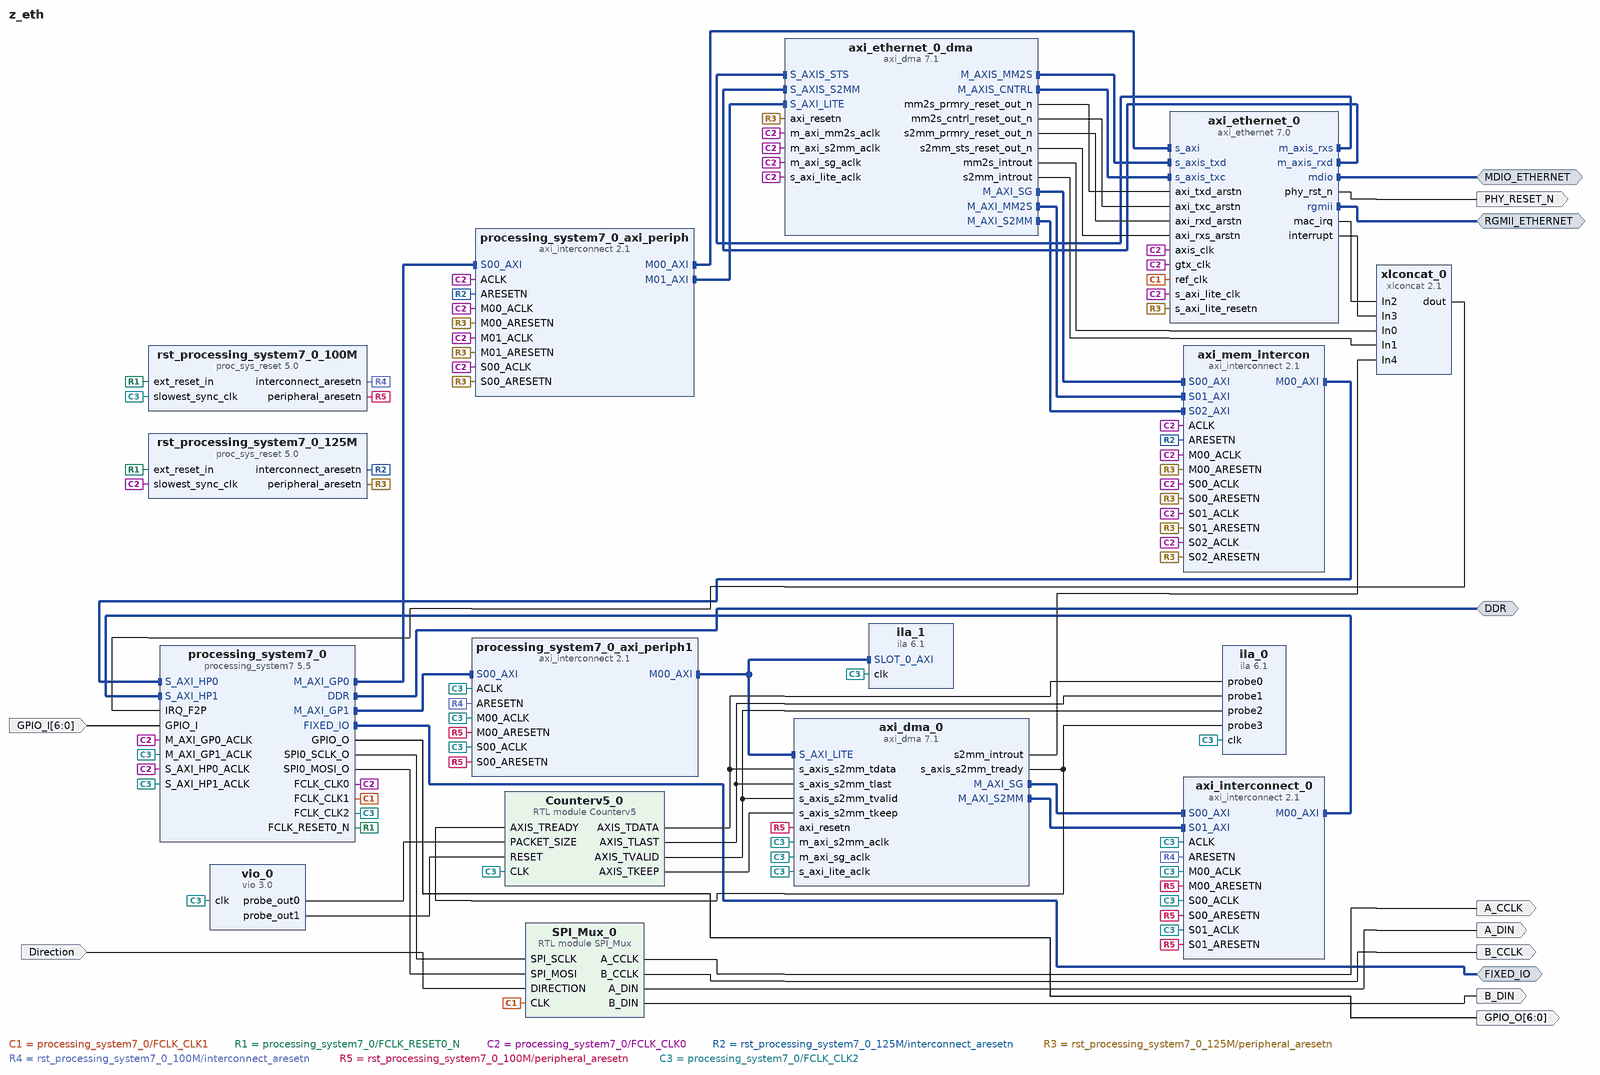
[diagram p0: block diagram of the top level]
# Vivado block design z_eth, Vivado 2016.1
create_bd_design z_eth

create_bd_intf_port -mode Master -vlnv xilinx.com:interface:ddrx_rtl:1.0 DDR
create_bd_intf_port -mode Master -vlnv xilinx.com:display_processing_system7:fixedio_rtl:1.0 FIXED_IO
create_bd_intf_port -mode Master -vlnv xilinx.com:interface:mdio_rtl:1.0 MDIO_ETHERNET
create_bd_intf_port -mode Master -vlnv xilinx.com:interface:rgmii_rtl:1.0 RGMII_ETHERNET
create_bd_port -dir O A_CCLK
create_bd_port -dir O B_CCLK
create_bd_port -dir O A_DIN
create_bd_port -dir O B_DIN
create_bd_port -dir I Direction
create_bd_port -dir O -from 6 -to 0 GPIO_O
create_bd_port -dir I -from 6 -to 0 GPIO_I
create_bd_port -dir O -type rst PHY_RESET_N
set_property -dict {CONFIG.POLARITY ACTIVE_LOW} [get_bd_ports PHY_RESET_N]

create_bd_cell -type ip -vlnv xilinx.com:ip:processing_system7:5.5 processing_system7_0
set_property -dict [list \
  CONFIG.PCW_SPI_PERIPHERAL_FREQMHZ 200 \
  CONFIG.PCW_FPGA0_PERIPHERAL_FREQMHZ 125 \
  CONFIG.PCW_FPGA1_PERIPHERAL_FREQMHZ 200 \
  CONFIG.PCW_FPGA2_PERIPHERAL_FREQMHZ 100 \
  CONFIG.PCW_USE_M_AXI_GP1 1 \
  CONFIG.PCW_USE_S_AXI_HP0 1 \
  CONFIG.PCW_USE_S_AXI_HP1 1 \
  CONFIG.PCW_USE_FABRIC_INTERRUPT 1 \
  CONFIG.PCW_EN_CLK1_PORT 1 \
  CONFIG.PCW_EN_CLK2_PORT 1 \
  CONFIG.PCW_IRQ_F2P_INTR 1 \
  CONFIG.PCW_UIPARAM_DDR_PARTNO {MT41J128M16 HA-125} \
  CONFIG.PCW_QSPI_PERIPHERAL_ENABLE 1 \
  CONFIG.PCW_QSPI_QSPI_IO {MIO 1 .. 6} \
  CONFIG.PCW_QSPI_GRP_SINGLE_SS_ENABLE 1 \
  CONFIG.PCW_ENET0_PERIPHERAL_ENABLE 0 \
  CONFIG.PCW_SD0_PERIPHERAL_ENABLE 1 \
  CONFIG.PCW_SD0_SD0_IO {MIO 16 .. 21} \
  CONFIG.PCW_SD0_GRP_CD_ENABLE 0 \
  CONFIG.PCW_UART0_PERIPHERAL_ENABLE 1 \
  CONFIG.PCW_UART0_UART0_IO {MIO 26 .. 27} \
  CONFIG.PCW_SPI0_PERIPHERAL_ENABLE 1 \
  CONFIG.PCW_SPI0_SPI0_IO EMIO \
  CONFIG.PCW_I2C0_PERIPHERAL_ENABLE 1 \
  CONFIG.PCW_I2C0_I2C0_IO {MIO 30 .. 31} \
  CONFIG.PCW_GPIO_MIO_GPIO_ENABLE 0 \
  CONFIG.PCW_GPIO_EMIO_GPIO_ENABLE 1 \
  CONFIG.PCW_GPIO_EMIO_GPIO_IO 7 \
] [get_bd_cells processing_system7_0]
# 3 more settings of processing_system7_0 are not shown: defaults, MIO pin electricals, DDR timing, and values the tool derives
create_bd_cell -type module -reference SPI_Mux SPI_Mux_0
create_bd_cell -type ip -vlnv xilinx.com:ip:axi_ethernet:7.0 axi_ethernet_0
set_property -dict [list \
  CONFIG.PHY_TYPE RGMII \
  CONFIG.RXMEM 16k \
  CONFIG.TXMEM 16k \
  CONFIG.TXCSUM Full \
  CONFIG.RXCSUM Full \
  CONFIG.Statistics_Counters false \
  CONFIG.axiliteclkrate 125 \
  CONFIG.axisclkrate 125 \
] [get_bd_cells axi_ethernet_0]
create_bd_cell -type ip -vlnv xilinx.com:ip:axi_dma:7.1 axi_ethernet_0_dma
set_property -dict [list \
  CONFIG.c_sg_length_width 16 \
  CONFIG.c_include_mm2s_dre 1 \
  CONFIG.c_mm2s_burst_size 256 \
  CONFIG.c_sg_use_stsapp_length 1 \
  CONFIG.c_include_s2mm_dre 1 \
  CONFIG.c_s2mm_burst_size 256 \
] [get_bd_cells axi_ethernet_0_dma]
create_bd_cell -type ip -vlnv xilinx.com:ip:axi_interconnect:2.1 axi_mem_intercon
set_property -dict {CONFIG.NUM_SI 3 CONFIG.NUM_MI 1} [get_bd_cells axi_mem_intercon]
create_bd_cell -type ip -vlnv xilinx.com:ip:proc_sys_reset:5.0 rst_processing_system7_0_125M
create_bd_cell -type ip -vlnv xilinx.com:ip:axi_interconnect:2.1 processing_system7_0_axi_periph
set_property -dict {CONFIG.NUM_MI 2} [get_bd_cells processing_system7_0_axi_periph]
create_bd_cell -type ip -vlnv xilinx.com:ip:xlconcat:2.1 xlconcat_0
set_property -dict {CONFIG.NUM_PORTS 5} [get_bd_cells xlconcat_0]
create_bd_cell -type ip -vlnv xilinx.com:ip:axi_dma:7.1 axi_dma_0
set_property -dict [list \
  CONFIG.c_sg_length_width 23 \
  CONFIG.c_sg_include_stscntrl_strm 0 \
  CONFIG.c_include_mm2s 0 \
  CONFIG.c_s2mm_burst_size 256 \
] [get_bd_cells axi_dma_0]
create_bd_cell -type ip -vlnv xilinx.com:ip:axi_interconnect:2.1 axi_interconnect_0
set_property -dict {CONFIG.NUM_SI 2 CONFIG.NUM_MI 1} [get_bd_cells axi_interconnect_0]
create_bd_cell -type module -reference Counterv5 Counterv5_0
create_bd_cell -type ip -vlnv xilinx.com:ip:proc_sys_reset:5.0 rst_processing_system7_0_100M
create_bd_cell -type ip -vlnv xilinx.com:ip:axi_interconnect:2.1 processing_system7_0_axi_periph1
set_property -dict {CONFIG.NUM_MI 1} [get_bd_cells processing_system7_0_axi_periph1]
create_bd_cell -type ip -vlnv xilinx.com:ip:vio:3.0 vio_0
set_property -dict [list \
  CONFIG.C_PROBE_OUT1_INIT_VAL 0x1 \
  CONFIG.C_PROBE_OUT0_INIT_VAL 0x00001000 \
  CONFIG.C_PROBE_OUT0_WIDTH 32 \
  CONFIG.C_NUM_PROBE_OUT 2 \
  CONFIG.C_EN_PROBE_IN_ACTIVITY 0 \
  CONFIG.C_NUM_PROBE_IN 0 \
] [get_bd_cells vio_0]
create_bd_cell -type ip -vlnv xilinx.com:ip:ila:6.1 ila_0
set_property -dict [list \
  CONFIG.C_PROBE1_WIDTH 1 \
  CONFIG.C_PROBE0_WIDTH 32 \
  CONFIG.C_DATA_DEPTH 4096 \
  CONFIG.C_NUM_OF_PROBES 4 \
  CONFIG.C_ENABLE_ILA_AXI_MON false \
  CONFIG.C_MONITOR_TYPE Native \
] [get_bd_cells ila_0]
create_bd_cell -type ip -vlnv xilinx.com:ip:ila:6.1 ila_1

# ---- connections ----

connect_bd_intf_net [get_bd_intf_pins axi_ethernet_0_dma/M_AXIS_MM2S] [get_bd_intf_pins axi_ethernet_0/s_axis_txd]
connect_bd_intf_net [get_bd_intf_pins axi_ethernet_0_dma/M_AXIS_CNTRL] [get_bd_intf_pins axi_ethernet_0/s_axis_txc]
connect_bd_intf_net [get_bd_intf_pins axi_ethernet_0_dma/S_AXIS_STS] [get_bd_intf_pins axi_ethernet_0/m_axis_rxs]
connect_bd_intf_net [get_bd_intf_pins axi_ethernet_0_dma/S_AXIS_S2MM] [get_bd_intf_pins axi_ethernet_0/m_axis_rxd]
connect_bd_intf_net [get_bd_intf_pins axi_ethernet_0_dma/M_AXI_SG] [get_bd_intf_pins axi_mem_intercon/S00_AXI]
connect_bd_intf_net [get_bd_intf_pins axi_mem_intercon/M00_AXI] [get_bd_intf_pins processing_system7_0/S_AXI_HP0]
connect_bd_intf_net [get_bd_intf_pins processing_system7_0/M_AXI_GP0] [get_bd_intf_pins processing_system7_0_axi_periph/S00_AXI]
connect_bd_intf_net [get_bd_intf_pins processing_system7_0_axi_periph/M00_AXI] [get_bd_intf_pins axi_ethernet_0/s_axi]
connect_bd_intf_net [get_bd_intf_pins processing_system7_0_axi_periph/M01_AXI] [get_bd_intf_pins axi_ethernet_0_dma/S_AXI_LITE]
connect_bd_intf_net [get_bd_intf_pins axi_ethernet_0_dma/M_AXI_MM2S] [get_bd_intf_pins axi_mem_intercon/S01_AXI]
connect_bd_intf_net [get_bd_intf_pins axi_ethernet_0_dma/M_AXI_S2MM] [get_bd_intf_pins axi_mem_intercon/S02_AXI]
connect_bd_intf_net [get_bd_intf_pins axi_dma_0/M_AXI_SG] [get_bd_intf_pins axi_interconnect_0/S00_AXI]
connect_bd_intf_net [get_bd_intf_pins axi_interconnect_0/S01_AXI] [get_bd_intf_pins axi_dma_0/M_AXI_S2MM]
connect_bd_intf_net [get_bd_intf_pins axi_interconnect_0/M00_AXI] [get_bd_intf_pins processing_system7_0/S_AXI_HP1]
connect_bd_intf_net [get_bd_intf_pins processing_system7_0/M_AXI_GP1] [get_bd_intf_pins processing_system7_0_axi_periph1/S00_AXI]
connect_bd_intf_net [get_bd_intf_pins axi_dma_0/S_AXI_LITE] [get_bd_intf_pins processing_system7_0_axi_periph1/M00_AXI]
connect_bd_intf_net [get_bd_intf_pins axi_dma_0/S_AXI_LITE] [get_bd_intf_pins ila_1/SLOT_0_AXI]
connect_bd_intf_net [get_bd_intf_ports DDR] [get_bd_intf_pins processing_system7_0/DDR]
connect_bd_intf_net [get_bd_intf_ports FIXED_IO] [get_bd_intf_pins processing_system7_0/FIXED_IO]
connect_bd_intf_net [get_bd_intf_ports MDIO_ETHERNET] [get_bd_intf_pins axi_ethernet_0/mdio]
connect_bd_intf_net [get_bd_intf_ports RGMII_ETHERNET] [get_bd_intf_pins axi_ethernet_0/rgmii]
connect_bd_net [get_bd_pins processing_system7_0/SPI0_SCLK_O] [get_bd_pins SPI_Mux_0/SPI_SCLK]
connect_bd_net [get_bd_pins processing_system7_0/SPI0_MOSI_O] [get_bd_pins SPI_Mux_0/SPI_MOSI]
connect_bd_net [get_bd_pins SPI_Mux_0/A_CCLK] [get_bd_ports A_CCLK]
connect_bd_net [get_bd_pins SPI_Mux_0/B_CCLK] [get_bd_ports B_CCLK]
connect_bd_net [get_bd_pins SPI_Mux_0/A_DIN] [get_bd_ports A_DIN]
connect_bd_net [get_bd_pins SPI_Mux_0/B_DIN] [get_bd_ports B_DIN]
connect_bd_net [get_bd_ports Direction] [get_bd_pins SPI_Mux_0/DIRECTION]
connect_bd_net [get_bd_pins processing_system7_0/GPIO_O] [get_bd_ports GPIO_O]
connect_bd_net [get_bd_ports GPIO_I] [get_bd_pins processing_system7_0/GPIO_I]
connect_bd_net [get_bd_pins axi_ethernet_0/phy_rst_n] [get_bd_ports PHY_RESET_N]
connect_bd_net [get_bd_pins processing_system7_0/FCLK_CLK1] [get_bd_pins axi_ethernet_0/ref_clk] [get_bd_pins SPI_Mux_0/CLK]
connect_bd_net [get_bd_pins axi_ethernet_0_dma/mm2s_prmry_reset_out_n] [get_bd_pins axi_ethernet_0/axi_txd_arstn]
connect_bd_net [get_bd_pins axi_ethernet_0_dma/mm2s_cntrl_reset_out_n] [get_bd_pins axi_ethernet_0/axi_txc_arstn]
connect_bd_net [get_bd_pins axi_ethernet_0_dma/s2mm_prmry_reset_out_n] [get_bd_pins axi_ethernet_0/axi_rxd_arstn]
connect_bd_net [get_bd_pins axi_ethernet_0_dma/s2mm_sts_reset_out_n] [get_bd_pins axi_ethernet_0/axi_rxs_arstn]
connect_bd_net [get_bd_pins processing_system7_0/FCLK_RESET0_N] \
  [get_bd_pins rst_processing_system7_0_125M/ext_reset_in] [get_bd_pins rst_processing_system7_0_100M/ext_reset_in]
connect_bd_net [get_bd_pins xlconcat_0/dout] [get_bd_pins processing_system7_0/IRQ_F2P]
connect_bd_net [get_bd_pins axi_ethernet_0_dma/mm2s_introut] [get_bd_pins xlconcat_0/In0]
connect_bd_net [get_bd_pins axi_ethernet_0_dma/s2mm_introut] [get_bd_pins xlconcat_0/In1]
connect_bd_net [get_bd_pins axi_ethernet_0/mac_irq] [get_bd_pins xlconcat_0/In2]
connect_bd_net [get_bd_pins axi_ethernet_0/interrupt] [get_bd_pins xlconcat_0/In3]
connect_bd_net [get_bd_pins processing_system7_0/FCLK_CLK0] \
  [get_bd_pins axi_ethernet_0_dma/s_axi_lite_aclk] [get_bd_pins axi_ethernet_0_dma/m_axi_sg_aclk] \
  [get_bd_pins axi_ethernet_0_dma/m_axi_mm2s_aclk] [get_bd_pins axi_ethernet_0_dma/m_axi_s2mm_aclk] \
  [get_bd_pins processing_system7_0/M_AXI_GP0_ACLK] [get_bd_pins processing_system7_0/S_AXI_HP0_ACLK] \
  [get_bd_pins axi_ethernet_0/s_axi_lite_clk] [get_bd_pins axi_ethernet_0/axis_clk] [get_bd_pins axi_ethernet_0/gtx_clk] \
  [get_bd_pins rst_processing_system7_0_125M/slowest_sync_clk] [get_bd_pins axi_mem_intercon/ACLK] \
  [get_bd_pins axi_mem_intercon/S00_ACLK] [get_bd_pins axi_mem_intercon/M00_ACLK] [get_bd_pins axi_mem_intercon/S01_ACLK] \
  [get_bd_pins axi_mem_intercon/S02_ACLK] [get_bd_pins processing_system7_0_axi_periph/ACLK] \
  [get_bd_pins processing_system7_0_axi_periph/S00_ACLK] [get_bd_pins processing_system7_0_axi_periph/M00_ACLK] \
  [get_bd_pins processing_system7_0_axi_periph/M01_ACLK]
connect_bd_net [get_bd_pins rst_processing_system7_0_125M/interconnect_aresetn] \
  [get_bd_pins processing_system7_0_axi_periph/ARESETN] [get_bd_pins axi_mem_intercon/ARESETN]
connect_bd_net [get_bd_pins rst_processing_system7_0_125M/peripheral_aresetn] \
  [get_bd_pins axi_ethernet_0/s_axi_lite_resetn] [get_bd_pins axi_ethernet_0_dma/axi_resetn] \
  [get_bd_pins axi_mem_intercon/S00_ARESETN] [get_bd_pins axi_mem_intercon/M00_ARESETN] \
  [get_bd_pins axi_mem_intercon/S01_ARESETN] [get_bd_pins axi_mem_intercon/S02_ARESETN] \
  [get_bd_pins processing_system7_0_axi_periph/S00_ARESETN] [get_bd_pins processing_system7_0_axi_periph/M00_ARESETN] \
  [get_bd_pins processing_system7_0_axi_periph/M01_ARESETN]
connect_bd_net [get_bd_pins axi_dma_0/s2mm_introut] [get_bd_pins xlconcat_0/In4]
connect_bd_net -net rst_processing_system7_0_125M1_interconnect_aresetn [get_bd_pins rst_processing_system7_0_100M/interconnect_aresetn] \
  [get_bd_pins processing_system7_0_axi_periph1/ARESETN] [get_bd_pins axi_interconnect_0/ARESETN]
connect_bd_net -net rst_processing_system7_0_125M1_peripheral_aresetn [get_bd_pins rst_processing_system7_0_100M/peripheral_aresetn] \
  [get_bd_pins axi_dma_0/axi_resetn] [get_bd_pins processing_system7_0_axi_periph1/S00_ARESETN] \
  [get_bd_pins processing_system7_0_axi_periph1/M00_ARESETN] [get_bd_pins axi_interconnect_0/S00_ARESETN] \
  [get_bd_pins axi_interconnect_0/M00_ARESETN] [get_bd_pins axi_interconnect_0/S01_ARESETN]
connect_bd_net [get_bd_pins processing_system7_0/FCLK_CLK2] \
  [get_bd_pins processing_system7_0/S_AXI_HP1_ACLK] [get_bd_pins axi_dma_0/s_axi_lite_aclk] \
  [get_bd_pins axi_dma_0/m_axi_sg_aclk] [get_bd_pins axi_dma_0/m_axi_s2mm_aclk] [get_bd_pins Counterv5_0/CLK] \
  [get_bd_pins rst_processing_system7_0_100M/slowest_sync_clk] [get_bd_pins processing_system7_0/M_AXI_GP1_ACLK] \
  [get_bd_pins vio_0/clk] [get_bd_pins ila_0/clk] [get_bd_pins axi_interconnect_0/ACLK] \
  [get_bd_pins axi_interconnect_0/S00_ACLK] [get_bd_pins axi_interconnect_0/M00_ACLK] \
  [get_bd_pins axi_interconnect_0/S01_ACLK] [get_bd_pins processing_system7_0_axi_periph1/ACLK] \
  [get_bd_pins processing_system7_0_axi_periph1/S00_ACLK] [get_bd_pins processing_system7_0_axi_periph1/M00_ACLK] \
  [get_bd_pins ila_1/clk]
connect_bd_net [get_bd_pins vio_0/probe_out0] [get_bd_pins Counterv5_0/PACKET_SIZE]
connect_bd_net [get_bd_pins vio_0/probe_out1] [get_bd_pins Counterv5_0/RESET]
connect_bd_net [get_bd_pins Counterv5_0/AXIS_TDATA] [get_bd_pins axi_dma_0/s_axis_s2mm_tdata] [get_bd_pins ila_0/probe0]
connect_bd_net [get_bd_pins Counterv5_0/AXIS_TKEEP] [get_bd_pins axi_dma_0/s_axis_s2mm_tkeep]
connect_bd_net [get_bd_pins Counterv5_0/AXIS_TLAST] [get_bd_pins axi_dma_0/s_axis_s2mm_tlast] [get_bd_pins ila_0/probe1]
connect_bd_net [get_bd_pins Counterv5_0/AXIS_TVALID] [get_bd_pins axi_dma_0/s_axis_s2mm_tvalid] [get_bd_pins ila_0/probe2]
connect_bd_net [get_bd_pins axi_dma_0/s_axis_s2mm_tready] [get_bd_pins Counterv5_0/AXIS_TREADY] [get_bd_pins ila_0/probe3]

# ---- address map ----
assign_bd_address -offset 0x00000000 -range 512M -target_address_space [get_bd_addr_spaces axi_dma_0/Data_S2MM] [get_bd_addr_segs processing_system7_0/S_AXI_HP1/HP1_DDR_LOWOCM]
assign_bd_address -offset 0x00000000 -range 512M -target_address_space [get_bd_addr_spaces axi_dma_0/Data_SG] [get_bd_addr_segs processing_system7_0/S_AXI_HP1/HP1_DDR_LOWOCM]
assign_bd_address -offset 0x00000000 -range 512M -target_address_space [get_bd_addr_spaces axi_ethernet_0_dma/Data_MM2S] [get_bd_addr_segs processing_system7_0/S_AXI_HP0/HP0_DDR_LOWOCM]
assign_bd_address -offset 0x00000000 -range 512M -target_address_space [get_bd_addr_spaces axi_ethernet_0_dma/Data_S2MM] [get_bd_addr_segs processing_system7_0/S_AXI_HP0/HP0_DDR_LOWOCM]
assign_bd_address -offset 0x00000000 -range 512M -target_address_space [get_bd_addr_spaces axi_ethernet_0_dma/Data_SG] [get_bd_addr_segs processing_system7_0/S_AXI_HP0/HP0_DDR_LOWOCM]
assign_bd_address -offset 0x40400000 -range 64K -target_address_space [get_bd_addr_spaces processing_system7_0/Data] [get_bd_addr_segs axi_ethernet_0_dma/S_AXI_LITE/Reg]
assign_bd_address -offset 0x41000000 -range 256K -target_address_space [get_bd_addr_spaces processing_system7_0/Data] [get_bd_addr_segs axi_ethernet_0/s_axi/Reg0]
assign_bd_address -offset 0x80400000 -range 64K -target_address_space [get_bd_addr_spaces processing_system7_0/Data] [get_bd_addr_segs axi_dma_0/S_AXI_LITE/Reg]

validate_bd_design
save_bd_design
